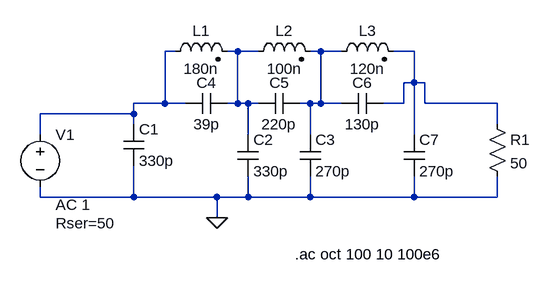
[diagram p0: schematic 30mhzlp.asc]
30mhzlp.asc, the LTspice schematic file:
Version 4
SHEET 1 1528 680
WIRE 176 32 160 32
WIRE 272 32 256 32
WIRE 304 32 272 32
WIRE 400 32 384 32
WIRE 432 32 400 32
WIRE 544 32 512 32
WIRE 544 80 544 32
WIRE 544 80 528 80
WIRE 560 80 544 80
WIRE 160 112 160 32
WIRE 160 112 112 112
WIRE 192 112 160 112
WIRE 272 112 272 32
WIRE 272 112 256 112
WIRE 288 112 272 112
WIRE 304 112 288 112
WIRE 384 112 368 112
WIRE 400 112 400 32
WIRE 400 112 384 112
WIRE 432 112 400 112
WIRE 528 112 528 80
WIRE 528 112 496 112
WIRE 560 112 560 80
WIRE 672 112 560 112
WIRE 112 128 112 112
WIRE 112 128 -32 128
WIRE 112 144 112 128
WIRE 672 144 672 112
WIRE -32 160 -32 128
WIRE 288 160 288 112
WIRE 384 160 384 112
WIRE 544 160 544 80
WIRE -32 256 -32 240
WIRE 112 256 112 208
WIRE 112 256 -32 256
WIRE 240 256 112 256
WIRE 288 256 288 224
WIRE 288 256 240 256
WIRE 384 256 384 224
WIRE 384 256 288 256
WIRE 544 256 544 224
WIRE 544 256 384 256
WIRE 672 256 672 224
WIRE 672 256 544 256
WIRE 240 288 240 256
FLAG 240 288 0
SYMBOL cap 272 160 R0
SYMATTR InstName C2
SYMATTR Value 330p
SYMBOL cap 368 160 R0
SYMATTR InstName C3
SYMATTR Value 270p
SYMATTR SpiceLine Rser=0.1
SYMBOL ind2 160 48 R270
WINDOW 0 32 56 VTop 2
WINDOW 3 5 56 VBottom 2
SYMATTR InstName L1
SYMATTR Value 180n
SYMATTR Type ind
SYMATTR SpiceLine Ipk=0.55 Rser=1 Cpar=0
SYMBOL ind2 288 48 R270
WINDOW 0 32 56 VTop 2
WINDOW 3 5 56 VBottom 2
SYMATTR InstName L2
SYMATTR Value 100n
SYMATTR Type ind
SYMATTR SpiceLine Ipk=0.55 Rser=1 Cpar=0
SYMBOL ind2 416 48 R270
WINDOW 0 32 56 VTop 2
WINDOW 3 5 56 VBottom 2
SYMATTR InstName L3
SYMATTR Value 120n
SYMATTR Type ind
SYMATTR SpiceLine Rser=1
SYMBOL res 656 128 R0
SYMATTR InstName R1
SYMATTR Value 50
SYMBOL voltage -32 144 R0
WINDOW 123 24 124 Left 2
WINDOW 39 24 152 Left 2
SYMATTR Value2 AC 1
SYMATTR SpiceLine Rser=50
SYMATTR InstName V1
SYMATTR Value ""
SYMBOL cap 96 144 R0
SYMATTR InstName C1
SYMATTR Value 330p
SYMATTR SpiceLine Rser=0.1
SYMBOL cap 256 96 R90
WINDOW 0 0 32 VBottom 2
WINDOW 3 32 32 VTop 2
SYMATTR InstName C4
SYMATTR Value 39p
SYMATTR SpiceLine Rser=0.1
SYMBOL cap 368 96 R90
WINDOW 0 0 32 VBottom 2
WINDOW 3 32 32 VTop 2
SYMATTR InstName C5
SYMATTR Value 220p
SYMATTR SpiceLine Rser=0.1
SYMBOL cap 496 96 R90
WINDOW 0 0 32 VBottom 2
WINDOW 3 32 32 VTop 2
SYMATTR InstName C6
SYMATTR Value 130p
SYMATTR SpiceLine Rser=0.1
SYMBOL cap 528 160 R0
SYMATTR InstName C7
SYMATTR Value 270p
SYMATTR SpiceLine Rser=0.1
TEXT 360 344 Left 2 !.ac oct 100 10 100e6

The netlist it stands for:
* 30mhzlp.asc
C2 N002 0 330p
C3 N003 0 270p Rser=0.1
L1 N001 N002 180n Ipk=0.55 Rser=1 Cpar=0
L2 N002 N003 100n Ipk=0.55 Rser=1 Cpar=0
L3 N003 N004 120n Rser=1
R1 N004 0 50
V1 N001 0 AC 1 Rser=50
C1 N001 0 330p Rser=0.1
C4 N002 N001 39p Rser=0.1
C5 N003 N002 220p Rser=0.1
C6 N004 N003 130p Rser=0.1
C7 N004 0 270p Rser=0.1
.ac oct 100 10 100e6
.backanno
.end